# Altium schematic sheet Block Diagram.SchDoc
size A4; SheetNumber: 2; SheetTotal: 4
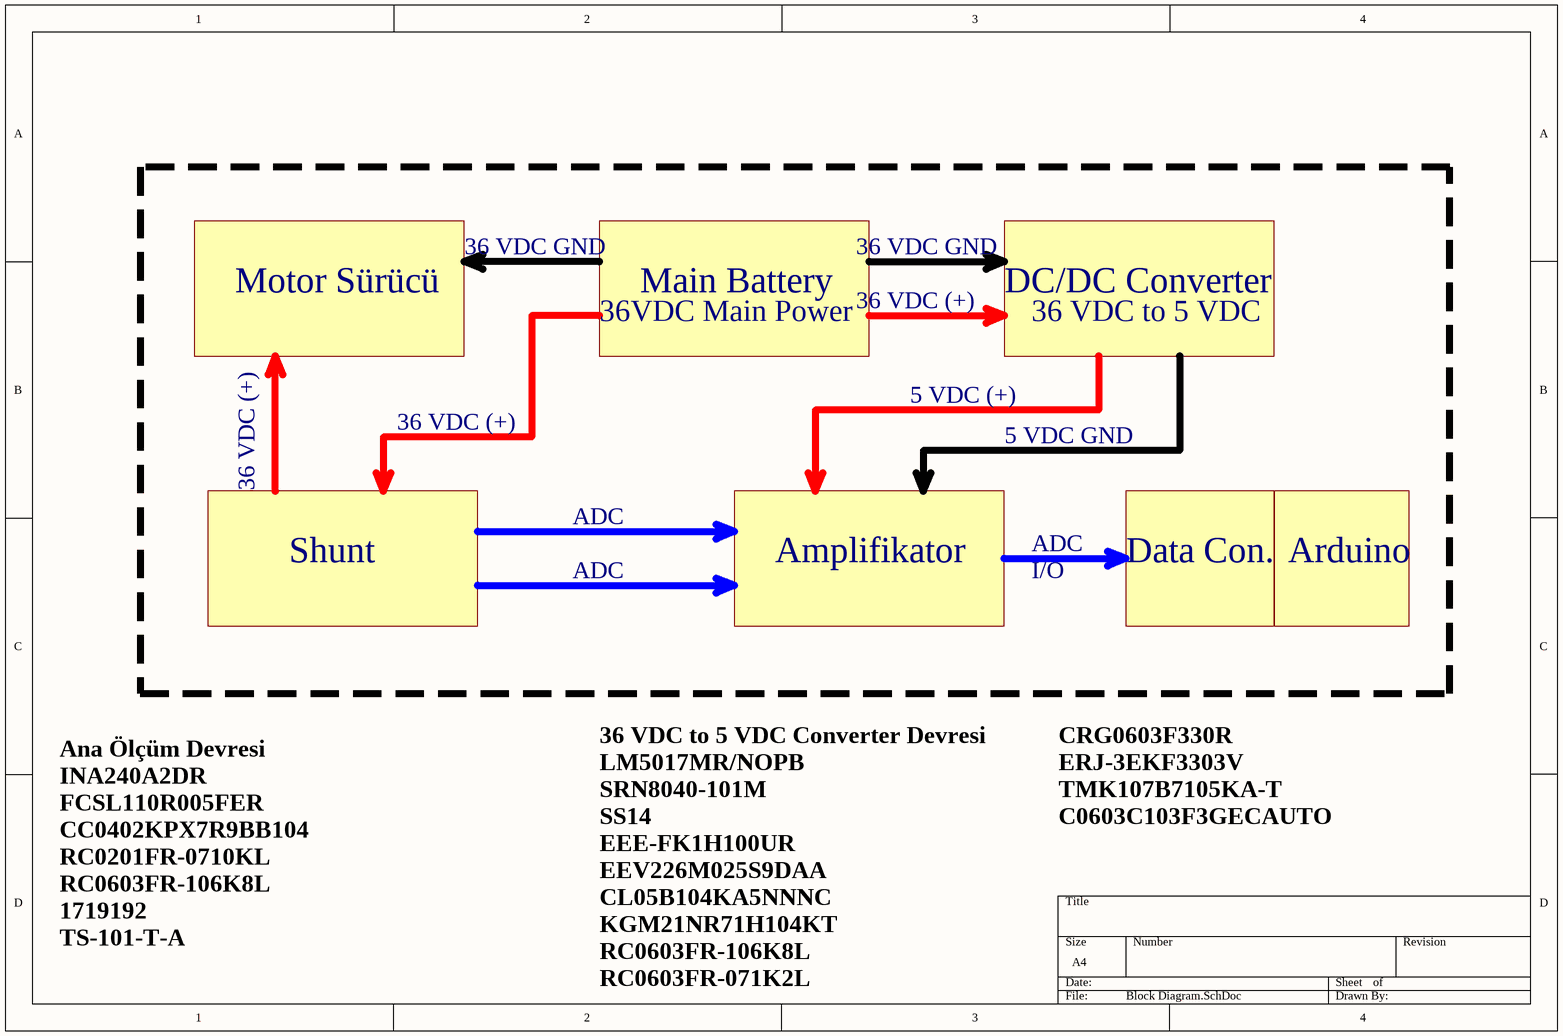
[diagram p0: Block Diagram.SchDoc]

## Notes on the sheet
- Motor Sürücü
- 36 VDC GND
- Main Battery
- 36 VDC (+)
- DC/DC Converter
- 36VDC Main Power
- 36 VDC to 5 VDC
- 5 VDC (+)
- 5 VDC GND
- Shunt
- ADC
- Amplifikator
- I/O
- Data Con.
- Arduino
- CRG0603F330R
  ERJ-3EKF3303V
  TMK107B7105KA-T
  C0603C103F3GECAUTO
- Ana Ölçüm Devresi
  INA240A2DR
  FCSL110R005FER
  CC0402KPX7R9BB104
  RC0201FR-0710KL
  RC0603FR-106K8L
  1719192
  TS-101-T-A
- 36 VDC to 5 VDC Converter Devresi
  LM5017MR/NOPB
  SRN8040-101M
  SS14
  EEE-FK1H100UR
  EEV226M025S9DAA
  CL05B104KA5NNNC
  KGM21NR71H104KT
  RC0603FR-106K8L
  RC0603FR-071K2L